# Altium schematic sheet Expansion.SchDoc: Port Expansion
size A4; DrawnBy: A. Küllenberg; Revision: A; SheetNumber: 6; SheetTotal: 10
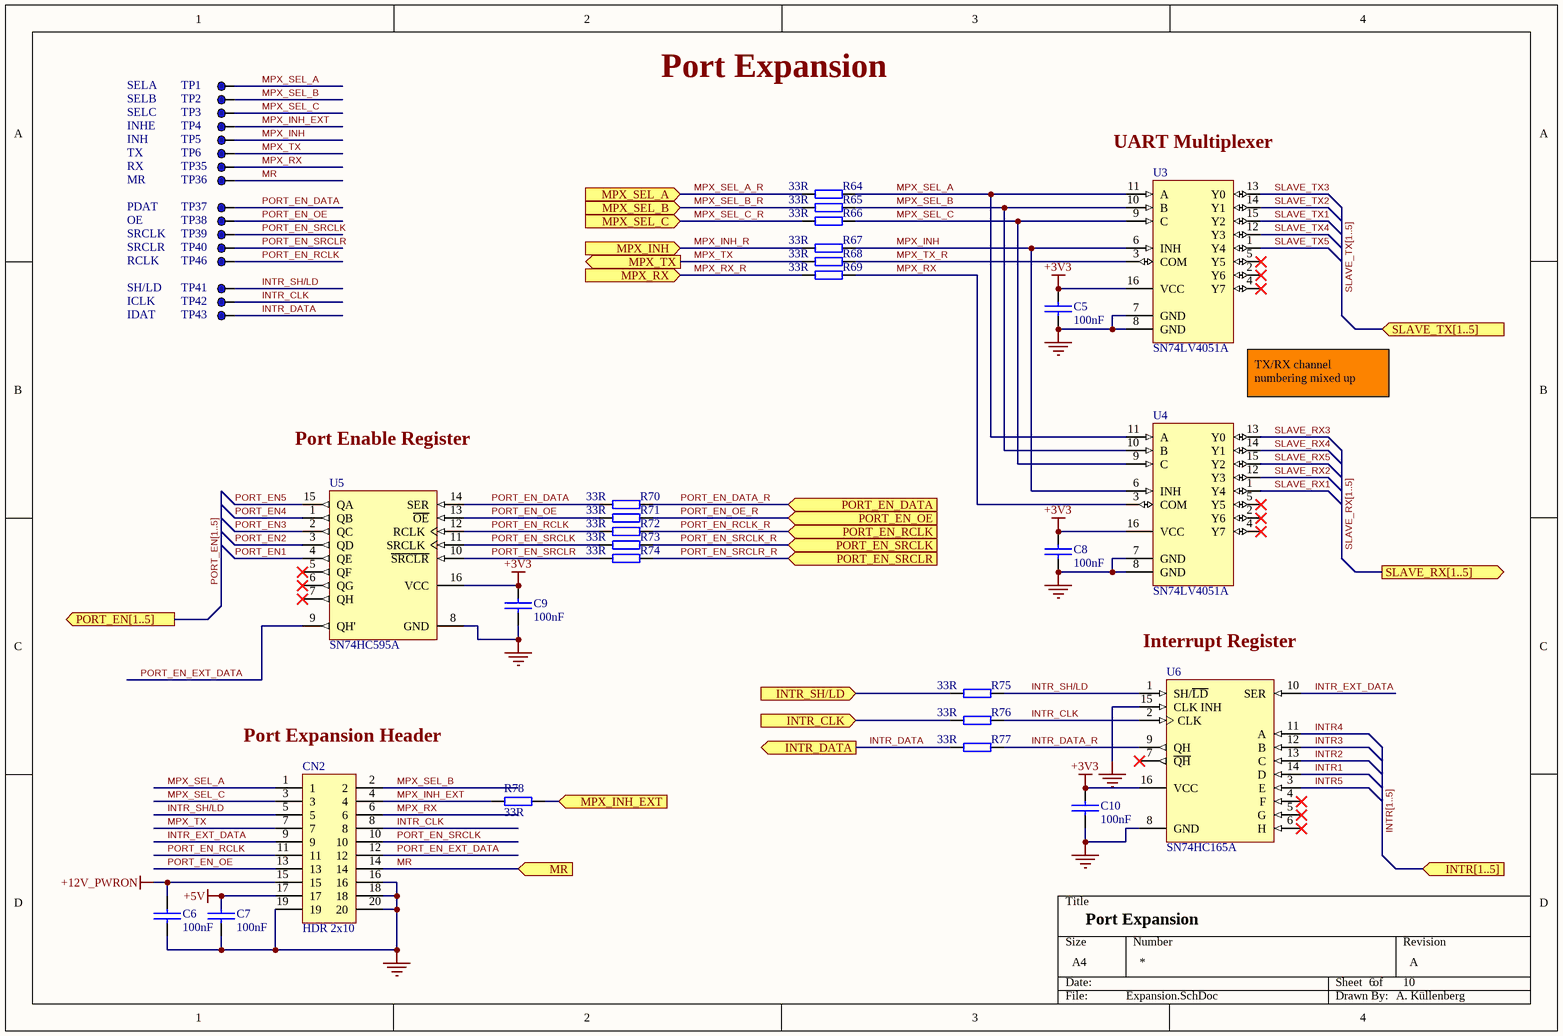
[diagram p0: Expansion.SchDoc]

## Parts
C5  100nF  [C0603]
C6  100nF  [C0603]
C7  100nF  [C0603]
C8  100nF  [C0603]
C9  100nF  [C0603]
C10  100nF  [C0603]
CN2  HDR 2x10  [SBH11-PBPC-D10-ST-BK]
R64  33R  [R0402]
R65  33R  [R0402]
R66  33R  [R0402]
R67  33R  [R0402]
R68  33R  [R0402]
R69  33R  [R0402]
R70  33R  [R0402]
R71  33R  [R0402]
R72  33R  [R0402]
R73  33R  [R0402]
R74  33R  [R0402]
R75  33R  [R0402]
R76  33R  [R0402]
R77  33R  [R0402]
R78  33R  [R0402]
TP1  SELA  [TP_1mm]  (no BOM)
TP2  SELB  [TP_1mm]  (no BOM)
TP3  SELC  [TP_1mm]  (no BOM)
TP4  INHE  [TP_1mm]  (no BOM)
TP5  INH  [TP_1mm]  (no BOM)
TP6  TX  [TP_1mm]  (no BOM)
TP35  RX  [TP_1mm]  (no BOM)
TP36  MR  [TP_1mm]  (no BOM)
TP37  PDAT  [TP_1mm]  (no BOM)
TP38  OE  [TP_1mm]  (no BOM)
TP39  SRCLK  [TP_1mm]  (no BOM)
TP40  SRCLR  [TP_1mm]  (no BOM)
TP41  SH/LD  [TP_1mm]  (no BOM)
TP42  ICLK  [TP_1mm]  (no BOM)
TP43  IDAT  [TP_1mm]  (no BOM)
TP46  RCLK  [TP_1mm]  (no BOM)
U3  SN74LV4051A  [TSOP65P640X120-16N]
U4  SN74LV4051A  [TSOP65P640X120-16N]
U5  SN74HC595A  [TSOP65P640X120-16N]
U6  SN74HC165A  [TSOP65P640X120-16N]

## Ports
INTR[1..5] (in), INTR_CLK (in), INTR_DATA (out), INTR_SH/LD (in), MPX_INH (in), MPX_INH_EXT (in), MPX_RX (in), MPX_SEL_A (in), MPX_SEL_B (in), MPX_SEL_C (in), MPX_TX (out), MR (in), PORT_EN[1..5] (out), PORT_EN_DATA (in), PORT_EN_OE (in), PORT_EN_RCLK (in), PORT_EN_SRCLK (in), PORT_EN_SRCLR (in), SLAVE_RX[1..5] (out), SLAVE_TX[1..5] (in)

## Nets
+3V3: C5.2 C8.2 C9.2 C10.2 U3.16(VCC) U4.16(VCC) U5.16(VCC) U6.16(VCC)
+5V: C7.2 CN2.17
+12V_PWRON: C6.2 CN2.15
GND: C5.1 C6.1 C7.1 C8.1 C9.1 C10.1 CN2.16 CN2.18 CN2.19 CN2.20 U3.7(GND) U3.8(GND) U4.7(GND) U4.8(GND) U5.8(GND) U6.8(GND) U6.15(CLK_INH)
INTR1: U6.14(D)
INTR2: U6.13(C)
INTR3: U6.12(B)
INTR4: U6.11(A)
INTR5: U6.3(E)
INTR_CLK: CN2.8 R76.2 TP42.1 U6.2(CLK)
INTR_CLK: R76.1 ; port INTR_CLK  [a separate net that carries the same name]
INTR_DATA: R77.1 TP43.1 ; port INTR_DATA
INTR_DATA_R: R77.2 U6.9(QH)
INTR_EXT_DATA: CN2.9 U6.10(SER)
INTR_SH/LD: CN2.5 R75.2 TP41.1 U6.1(SH/~{LD})
INTR_SH/LD: R75.1 ; port INTR_SH/LD  [a separate net that carries the same name]
MPX_INH: R67.2 TP5.1 U3.6(INH) U4.6(INH)
MPX_INH_EXT: CN2.4 R78.1 TP4.1
MPX_INH_EXT: R78.2 ; port MPX_INH_EXT  [a separate net that carries the same name]
MPX_INH_R: R67.1 ; port MPX_INH
MPX_RX: CN2.6 R69.2 TP35.1 U4.3(COM)
MPX_RX_R: R69.1 ; port MPX_RX
MPX_SEL_A: CN2.1 R64.2 TP1.1 U3.11(A) U4.11(A)
MPX_SEL_A_R: R64.1 ; port MPX_SEL_A
MPX_SEL_B: CN2.2 R65.2 TP2.1 U3.10(B) U4.10(B)
MPX_SEL_B_R: R65.1 ; port MPX_SEL_B
MPX_SEL_C: CN2.3 R66.2 TP3.1 U3.9(C) U4.9(C)
MPX_SEL_C_R: R66.1 ; port MPX_SEL_C
MPX_TX: CN2.7 R68.1 TP6.1 ; port MPX_TX
MPX_TX_R: R68.2 U3.3(COM)
MR: CN2.14 TP36.1 ; port MR
PORT_EN1: U5.4(QE)
PORT_EN2: U5.3(QD)
PORT_EN3: U5.2(QC)
PORT_EN4: U5.1(QB)
PORT_EN5: U5.15(QA)
PORT_EN_DATA: R70.1 TP37.1 U5.14(SER)
PORT_EN_DATA_R: R70.2 ; port PORT_EN_DATA
PORT_EN_EXT_DATA: CN2.12 U5.9(QH')
PORT_EN_OE: CN2.13 R71.1 TP38.1 U5.13(~{OE})
PORT_EN_OE_R: R71.2 ; port PORT_EN_OE
PORT_EN_RCLK: CN2.11 R72.1 TP46.1 U5.12(RCLK)
PORT_EN_RCLK_R: R72.2 ; port PORT_EN_RCLK
PORT_EN_SRCLK: CN2.10 R73.1 TP39.1 U5.11(SRCLK)
PORT_EN_SRCLK_R: R73.2 ; port PORT_EN_SRCLK
PORT_EN_SRCLR: R74.1 TP40.1 U5.10(~{SRCLR})
PORT_EN_SRCLR_R: R74.2 ; port PORT_EN_SRCLR
SLAVE_RX1: U4.1(Y4)
SLAVE_RX2: U4.12(Y3)
SLAVE_RX3: U4.13(Y0)
SLAVE_RX4: U4.14(Y1)
SLAVE_RX5: U4.15(Y2)
SLAVE_TX1: U3.15(Y2)
SLAVE_TX2: U3.14(Y1)
SLAVE_TX3: U3.13(Y0)
SLAVE_TX4: U3.12(Y3)
SLAVE_TX5: U3.1(Y4)

Not connected (* = marked no-connect by the designer): U3 2(Y6)* 4(Y7)* 5(Y5)*; U4 2(Y6)* 4(Y7)* 5(Y5)*; U5 5(QF)* 6(QG)* 7(QH)*; U6 4(F)* 5(G)* 6(H)* 7(~{QH})*

## Buses and harness runs
bus INTR[1..5] = port INTR[1..5]
bus PORT_EN[1..5] = port PORT_EN[1..5]
bus SLAVE_RX[1..5] = port SLAVE_RX[1..5]
bus SLAVE_TX[1..5] = port SLAVE_TX[1..5]

## Notes on the sheet
- Port Expansion
- (near U3) UART Multiplexer
- Port Enable Register
- (near U3) TX/RX channel numbering mixed up
- Interrupt Register
- (near CN2) Port Expansion Header

## Library data of the parts
C5-C10 = C0603C104K5RACTU: CAP CER 0.1UF 50V X7R 0603; Manufacturer: Kemet; Capacitance: 0.10µF; Tolerance: ±10%; Part Number: C0603C104K5RACTU; Value: 100nF; Supplier 1: Digi-Key; Supplier Part Number 1: 399-5089-1-ND; Manufacturer Part Number: C0603C104K5RACTU; RoHS: RoHS Compliant; Category: Capacitors; Stock 1: 1628757; Pricing 1: 1=0.09, 10=0.037, 50=0.0198, 100=0.0167, 250=0.01372, 500=0.01174, 1000=0.00914 (EUR); Packaging: Cut Tape (CT); Voltage - Rated: 50V; Temperature Coefficient: X7R; Mounting Type: Surface Mount, MLCC; Operating Temperature: -55°C ~ 125°C; Applications: General Purpose; Ratings: -; Package / Case: 0603 (1608 Metric); Size / Dimension: 0.063" L x 0.031" W (1.60mm x 0.80mm); Height - Seated (Max): -; Thickness (Max): 0.034" (0.87mm); Lead Spacing: -; Features: -; Lead Style: -; ComponentLink1URL: http://www.kemet.com/docfinder?Partnumber=C0603C104K5RACTU; ComponentLink1Description: http://www.kemet.com/docfinder?Partnumber=C0603C104K5RACTU
CN2 = SBH11-PBPC-D10-ST-BK: CONN HEADER 2.54MM 20POS GOLD; Manufacturer: Sullins Connector Solutions; Number of Positions: 20; Number of Positions Loaded: All; Current Rating: 3A; Pitch - Mating: 0.100" (2.54mm); Shrouding: Shrouded - 4 Wall; Style: Board to Board or Cable; Contact Length - Post: 0.118" (3.00mm); Material Flammability Rating: UL94 V-0; Mated Stacking Heights: 9.65mm, 11.2mm, 13.35mm, 18.35mm; Part Number: SBH11-PBPC-D10-ST-BK; Value: HDR 2x10; Supplier 1: Digi-Key; Supplier Part Number 1: S9172-ND; Manufacturer Part Number: SBH11-PBPC-D10-ST-BK; RoHS: RoHS Compliant; Category: Connectors, Interconnects; Stock 1: 24456; Pricing 1: 1=0.68, 10=0.527, 25=0.4904, 50=0.4462, 100=0.4015, 250=0.339, 500=0.32114, 1000=0.28547, 2500=0.2373 (EUR); Packaging: Tray; Connector Type: Header; Contact Type: Male Pin; Number of Rows: 2; Mounting Type: Through Hole; Termination: Solder; Fastening Type: -; Features: Keying Slot; ComponentLink1URL: http://sullinscorp.com/catalogs/145_PAGE118_.100_SBH11_SERIES_MALE_BOX_HDR_ST_RA_SMT.pdf; ComponentLink1Description: http://sullinscorp.com/catalogs/145_PAGE118_.100_SBH11_SERIES_MALE_BOX_HDR_ST_RA_SMT.pdf; Voltage Rating: -; Contact Material: Brass; Operating Temperature: -40°C ~ 105°C; Part Status: Active; Row Spacing - Mating: 0.100" (2.54mm); Contact Length - Mating: -; Contact Finish - Mating: Gold; Contact Finish Thickness - Mating: Flash; Insulation Color: Black; Overall Contact Length: -; Insulation Height: 0.358" (9.10mm); Contact Shape: Square; Ingress Protection: -; Contact Finish - Post: Gold; Insulation Material: Polybutylene Terephthalate (PBT); Contact Finish Thickness - Post: Flash; Applications: -
R64-R78 = RC0402FR-0733RL: RES SMD 33 OHM 1% 1/16W 0402; Manufacturer: Yageo; Resistance (Ohms): 33; Power (Watts): 0.063W, 1/16W; Temperature Coefficient: ±100ppm/°C; Part Number: RC0402FR-0733RL; Value: 33R; Manufacturer Part Number: RC0402FR-0733RL; RoHS: RoHS Compliant; Category: Resistors; Stock 1: 1076015; Pricing 1: 1=0.09, 10=0.012, 100=0.005, 1000=0.00222, 2500=0.00193, 5000=0.00159 (EUR); Packaging: Cut Tape (CT); Tolerance: ±1%; Composition: Thick Film; Features: Moisture Resistant; Operating Temperature: -55°C ~ 155°C; Package / Case: 0402 (1005 Metric); Supplier Device Package: 0402; Size / Dimension: 0.039" L x 0.020" W (1.00mm x 0.50mm); ComponentLink1URL: http://www.yageo.com/documents/recent/PYu-RC_Group_51_RoHS_L_7.pdf; ComponentLink1Description: http://www.yageo.com/documents/recent/PYu-RC_Group_51_RoHS_L_7.pdf; Supplier 1: Digi-Key; Supplier Part Number 1: 311-33.0LRCT-ND; Height - Seated (Max): 0.016" (0.40mm); Part Status: Active; Failure Rate: -
TP1-TP6 TP35-TP43 TP46 = TP: Value: TP; Part Number: TP
U3 U4 = SN74LV4051APWR: IC MUX/DEMUX 8X1 16TSSOP; Manufacturer: Texas Instruments; Number of Circuits: 1; Multiplexer/Demultiplexer Circuit: 8:1; On-State Resistance (Max): 75 Ohm; Part Number: SN74LV4051APWR; Value: SN74LV4051A; Supplier 1: Digi-Key; Supplier Part Number 1: 296-3829-1-ND; Manufacturer Part Number: SN74LV4051APWR; RoHS: RoHS Compliant; Category: Integrated Circuits (ICs); Stock 1: 15950; Pricing 1: 1=0.42, 10=0.364, 100=0.2722, 500=0.21392, 1000=0.16529 (EUR); Packaging: Cut Tape (CT); ComponentLink1URL: http://www.ti.com/lit/ds/symlink/sn74lv4051a.pdf; ComponentLink1Description: http://www.ti.com/lit/ds/symlink/sn74lv4051a.pdf; Part Status: Active; Switch Circuit: -
U5 = SN74LV595APWRG3: IC SHIFT REGISTR 8B 3ST 16TSSOP; Manufacturer: Texas Instruments; Logic Type: Shift Register; Voltage - Supply: 2 V ~ 5.5 V; Output Type: Tri-State; Number of Bits per Element: 8; Function: Serial to Parallel, Serial; Part Number: SN74LV595APWRG3; Value: SN74HC595A; Supplier 1: Digi-Key; Supplier Part Number 1: 296-31886-1-ND; Manufacturer Part Number: SN74LV595APWRG3; RoHS: RoHS Compliant; Category: Integrated Circuits (ICs); Stock 1: 1165; Pricing 1: 1=0.84, 10=0.738, 100=0.5658, 500=0.44726, 1000=0.35781 (EUR); Packaging: Cut Tape (CT); Operating Temperature: -40°C ~ 85°C; Mounting Type: Surface Mount; Supplier Device Package: 16-TSSOP; Package / Case: 16-TSSOP (0.173", 4.40mm Width); ComponentLink1URL: http://www.ti.com/lit/ds/symlink/sn74lv595a.pdf; ComponentLink1Description: http://www.ti.com/lit/ds/symlink/sn74lv595a.pdf; Part Status: Active
U6 = SN74LV165APWRG3: IC SHIFT REGISTER 8BIT 16TSSOP; Manufacturer: Texas Instruments; Voltage - Supply: 2 V ~ 5.5 V; Output Type: Complementary; Number of Bits per Element: 8; Function: Parallel or Serial to Serial; Part Number: SN74LV165APWRG3; Value: SN74HC165A; Supplier 1: Digi-Key; Supplier Part Number 1: 296-31867-1-ND; Manufacturer Part Number: SN74LV165APWRG3; RoHS: RoHS Compliant; Category: Integrated Circuits (ICs); Stock 1: 6590; Pricing 1: 1=0.43, 10=0.368, 100=0.275, 500=0.21604, 1000=0.16695 (EUR); Packaging: Cut Tape (CT); Logic Type: Shift Register; Operating Temperature: -40°C ~ 125°C; Mounting Type: Surface Mount; Supplier Device Package: 16-TSSOP; Package / Case: 16-TSSOP (0.173", 4.40mm Width); ComponentLink1URL: http://www.ti.com/lit/ds/symlink/sn74lv165a.pdf; ComponentLink1Description: http://www.ti.com/lit/ds/symlink/sn74lv165a.pdf; Part Status: Active